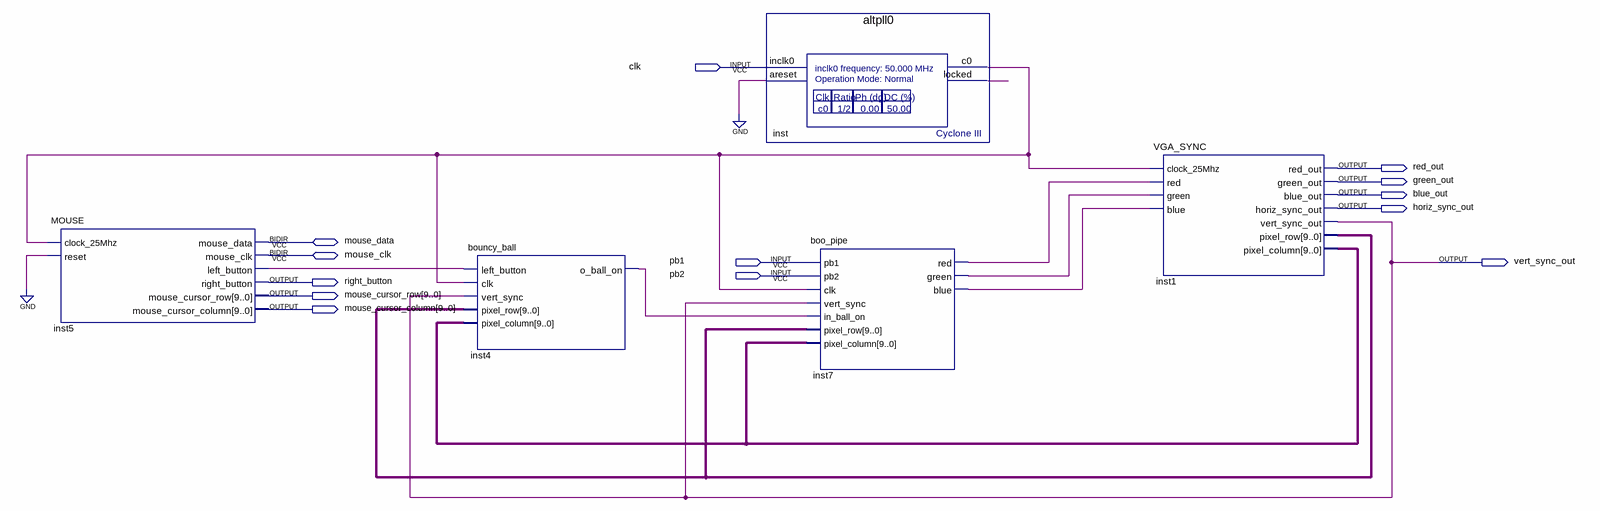
[diagram p0: schematic sheet]
// Quartus schematic VGAExample.bdf as structural Verilog: 5 symbols, 13 pins
module VGAExample (
  input  clk,
  input  pb1,
  input  pb2,
  inout  mouse_data,
  inout  mouse_clk,
  output red_out,
  output green_out,
  output blue_out,
  output horiz_sync_out,
  output vert_sync_out,
  output right_button,
  output [9:0] mouse_cursor_row,
  output [9:0] mouse_cursor_column
);

  wire inst4_o_ball_on, inst5_left_button, inst7_blue, inst7_green, inst7_red, inst_c0, inst_locked;
  wire [9:0] inst1_pixel_column, inst1_pixel_row;

  MOUSE inst5 (
    .clock_25Mhz(inst_c0), .reset(1'b0), .left_button(inst5_left_button), .right_button(right_button),
    .mouse_cursor_row(mouse_cursor_row), .mouse_cursor_column(mouse_cursor_column), .mouse_data(mouse_data),
    .mouse_clk(mouse_clk));
  bouncy_ball inst4 (
    .left_button(inst5_left_button), .clk(inst_c0), .vert_sync(vert_sync_out), .pixel_row(inst1_pixel_row),
    .pixel_column(inst1_pixel_column), .o_ball_on(inst4_o_ball_on));
  altpll0 inst (.inclk0(clk), .areset(1'b0), .c0(inst_c0), .locked(inst_locked));
  boo_pipe inst7 (
    .pb1(pb1), .pb2(pb2), .clk(inst_c0), .vert_sync(vert_sync_out), .in_ball_on(inst4_o_ball_on),
    .pixel_row(inst1_pixel_row), .pixel_column(inst1_pixel_column), .red(inst7_red), .green(inst7_green),
    .blue(inst7_blue));
  VGA_SYNC inst1 (
    .clock_25Mhz(inst_c0), .red(inst7_red), .green(inst7_green), .blue(inst7_blue), .red_out(red_out),
    .green_out(green_out), .blue_out(blue_out), .horiz_sync_out(horiz_sync_out),
    .vert_sync_out(vert_sync_out), .pixel_row(inst1_pixel_row), .pixel_column(inst1_pixel_column));
endmodule
